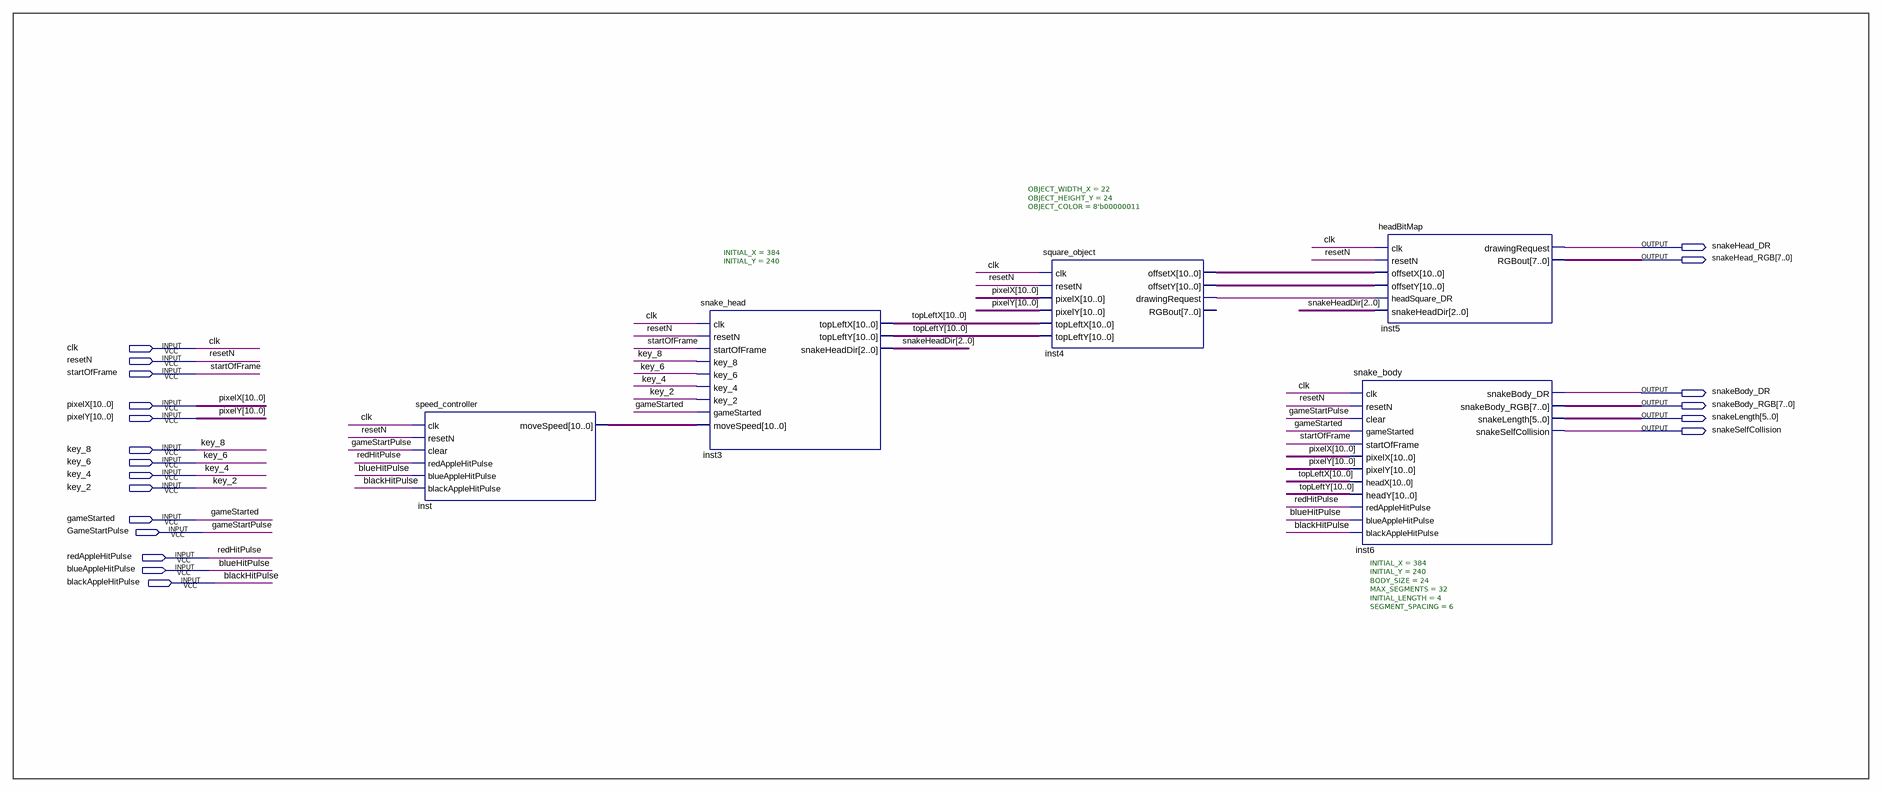
[diagram p0: schematic sheet]
// Quartus schematic Snake_Block.bdf as structural Verilog: 5 symbols, 20 pins
module Snake_Block (
  input  clk,
  input  resetN,
  input  startOfFrame,
  input  [10:0] pixelX,
  input  [10:0] pixelY,
  input  key_8,
  input  key_6,
  input  key_4,
  input  key_2,
  input  gameStarted,
  input  GameStartPulse,
  input  redAppleHitPulse,
  input  blueAppleHitPulse,
  input  blackAppleHitPulse,
  output snakeHead_DR,
  output [7:0] snakeHead_RGB,
  output snakeBody_DR,
  output [7:0] snakeBody_RGB,
  output [5:0] snakeLength,
  output snakeSelfCollision
);

  wire inst4_drawingrequest;
  wire [2:0] snakeHeadDir;
  wire [10:0] inst4_offsetx, inst4_offsety, inst_movespeed, topLeftX, topLeftY;

  speed_controller inst (
    .clk(clk), .resetN(resetN), .clear(GameStartPulse), .redAppleHitPulse(redAppleHitPulse),
    .blueAppleHitPulse(blueAppleHitPulse), .blackAppleHitPulse(blackAppleHitPulse), .moveSpeed(inst_movespeed));
  snake_head #(.INITIAL_X(384), .INITIAL_Y(240)) inst3 (
    .clk(clk), .resetN(resetN), .startOfFrame(startOfFrame), .key_8(key_8), .key_6(key_6), .key_4(key_4),
    .key_2(key_2), .gameStarted(gameStarted), .moveSpeed(inst_movespeed), .topLeftX(topLeftX),
    .topLeftY(topLeftY), .snakeHeadDir(snakeHeadDir));
  square_object #(.OBJECT_WIDTH_X(22), .OBJECT_HEIGHT_Y(24), .OBJECT_COLOR(8'b00000011)) inst4 (
    .clk(clk), .resetN(resetN), .pixelX(pixelX), .pixelY(pixelY), .topLeftX(topLeftX), .topLeftY(topLeftY),
    .offsetX(inst4_offsetx), .offsetY(inst4_offsety), .drawingRequest(inst4_drawingrequest));  // open: RGBout
  headBitMap inst5 (
    .clk(clk), .resetN(resetN), .offsetX(inst4_offsetx), .offsetY(inst4_offsety),
    .headSquare_DR(inst4_drawingrequest), .snakeHeadDir(snakeHeadDir), .drawingRequest(snakeHead_DR),
    .RGBout(snakeHead_RGB));
  snake_body #(.INITIAL_X(384), .INITIAL_Y(240), .BODY_SIZE(24), .MAX_SEGMENTS(32), .INITIAL_LENGTH(4), .SEGMENT_SPACING(6)) inst6 (
    .clk(clk), .resetN(resetN), .clear(GameStartPulse), .gameStarted(gameStarted),
    .startOfFrame(startOfFrame), .pixelX(pixelX), .pixelY(pixelY), .headX(topLeftX), .headY(topLeftY),
    .redAppleHitPulse(redAppleHitPulse), .blueAppleHitPulse(blueAppleHitPulse),
    .blackAppleHitPulse(blackAppleHitPulse), .snakeBody_DR(snakeBody_DR), .snakeBody_RGB(snakeBody_RGB),
    .snakeLength(snakeLength), .snakeSelfCollision(snakeSelfCollision));

  // Other names for the same wires on the sheet: blackHitPulse = blackAppleHitPulse; blueHitPulse = blueAppleHitPulse;
  //   redHitPulse = redAppleHitPulse
endmodule
